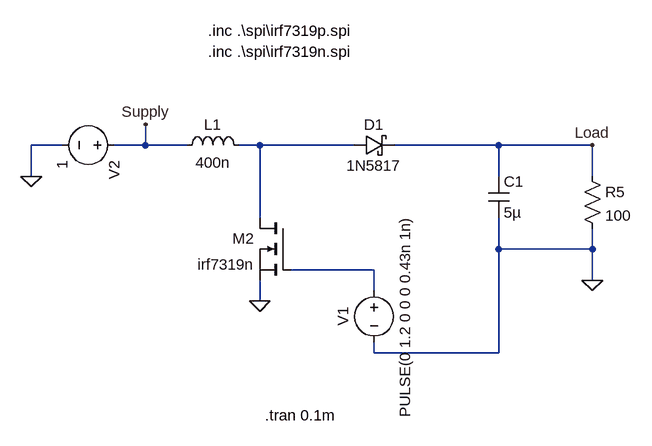
[diagram p0: schematic boost.asc]
boost.asc, the LTspice schematic file:
Version 4
SHEET 1 1028 680
WIRE -480 -128 -528 -128
WIRE -352 -128 -352 -160
WIRE -352 -128 -400 -128
WIRE -288 -128 -352 -128
WIRE -176 -128 -208 -128
WIRE -32 -128 -176 -128
WIRE 192 -128 32 -128
WIRE 336 -128 192 -128
WIRE -528 -80 -528 -128
WIRE 192 -80 192 -128
WIRE 336 -80 336 -128
WIRE -176 -16 -176 -128
WIRE 192 32 192 -16
WIRE 336 32 336 0
WIRE 336 32 192 32
WIRE 0 64 -128 64
WIRE 336 80 336 32
WIRE 0 96 0 64
WIRE -176 112 -176 80
WIRE 0 192 0 176
WIRE 192 192 192 32
WIRE 192 192 0 192
FLAG -176 112 0
FLAG -528 -80 0
FLAG 336 -128 Load
FLAG -352 -160 Supply
FLAG 336 80 0
SYMBOL voltage -384 -128 R90
WINDOW 123 0 0 Left 2
WINDOW 39 0 0 Left 2
SYMATTR InstName V2
SYMATTR Value 1
SYMBOL res 320 -96 R0
SYMATTR InstName R5
SYMATTR Value 100
SYMBOL voltage 0 80 R0
WINDOW 0 -32 56 VBottom 2
WINDOW 3 32 56 VTop 2
WINDOW 123 0 0 Left 2
WINDOW 39 0 0 Left 2
SYMATTR InstName V1
SYMATTR Value PULSE(0 1.2 0 0 0 0.43n 1n)
SYMBOL schottky -32 -112 R270
WINDOW 0 32 32 VTop 2
WINDOW 3 0 32 VBottom 2
SYMATTR InstName D1
SYMATTR Value 1N5817
SYMATTR Description Diode
SYMATTR Type diode
SYMBOL cap 176 -80 R0
SYMATTR InstName C1
SYMATTR Value 5µ
SYMBOL ind -304 -112 R270
WINDOW 0 32 56 VTop 2
WINDOW 3 5 56 VBottom 2
SYMATTR InstName L1
SYMATTR Value 400n
SYMATTR SpiceLine Ipk=111 Rser=0.0005 Rpar=37.68 Cpar=0
SYMBOL nmos -128 -16 M0
SYMATTR InstName M2
SYMATTR Value irf7319n
SYMATTR Prefix X
TEXT -256 -304 Left 2 !.inc .\\spi\\irf7319p.spi
TEXT -256 -272 Left 2 !.inc .\\spi\\irf7319n.spi
TEXT -168 288 Left 2 !.tran 0.1m

The netlist it stands for:
* boost.asc
V2 Supply 0 1
R5 Load 0 100
V1 N002 0 PULSE(0 1.2 0 0 0 0.43n 1n)
D1 N001 Load 1N5817
C1 Load 0 5µ
L1 Supply N001 400n Ipk=111 Rser=0.0005 Rpar=37.68 Cpar=0
XM2 N001 N002 0 irf7319n  ; pins D G S
.model D D
.lib standard.dio
.inc .\spi\irf7319p.spi
.inc .\spi\irf7319n.spi
.tran 0.1m
.backanno
.end